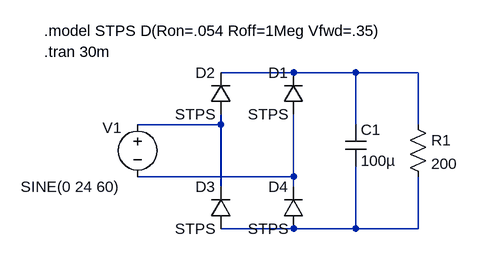
[diagram p0: schematic RectifierC100.asc]
RectifierC100.asc, the LTspice schematic file:
Version 4.1
SHEET 1 880 680
WIRE 240 32 128 32
WIRE 336 32 240 32
WIRE 432 32 336 32
WIRE 128 112 128 96
WIRE 128 112 0 112
WIRE 336 112 336 32
WIRE 432 112 432 32
WIRE 240 192 240 96
WIRE 240 192 0 192
WIRE 128 208 128 112
WIRE 240 208 240 192
WIRE 240 272 128 272
WIRE 336 272 336 176
WIRE 336 272 240 272
WIRE 432 272 432 192
WIRE 432 272 336 272
SYMBOL voltage 0 96 R0
WINDOW 0 -54 21 Left 2
WINDOW 3 -180 112 Left 2
WINDOW 123 0 0 Left 0
WINDOW 39 0 0 Left 0
SYMATTR InstName V1
SYMATTR Value SINE(0 24 60)
SYMBOL res 416 96 R0
SYMATTR InstName R1
SYMATTR Value 200
SYMBOL diode 256 96 R180
WINDOW 0 24 64 Left 2
WINDOW 3 24 0 Left 2
SYMATTR InstName D1
SYMATTR Value STPS
SYMBOL diode 144 96 R180
WINDOW 0 24 64 Left 2
WINDOW 3 24 0 Left 2
SYMATTR InstName D2
SYMATTR Value STPS
SYMBOL diode 144 272 R180
WINDOW 0 24 64 Left 2
WINDOW 3 24 0 Left 2
SYMATTR InstName D3
SYMATTR Value STPS
SYMBOL diode 256 272 R180
WINDOW 0 24 64 Left 2
WINDOW 3 24 0 Left 2
SYMATTR InstName D4
SYMATTR Value STPS
SYMBOL cap 320 112 R0
SYMATTR InstName C1
SYMATTR Value 100µ
TEXT -144 -32 Left 2 !.model STPS D(Ron=.054 Roff=1Meg Vfwd=.35)
TEXT -144 0 Left 2 !.tran 30m

The netlist it stands for:
* RectifierC100.asc
V1 N002 N003 SINE(0 24 60)
R1 N001 N004 200
D1 N003 N001 STPS
D2 N002 N001 STPS
D3 N004 N002 STPS
D4 N004 N003 STPS
C1 N001 N004 100µ
.model D D
.lib standard.dio
.model STPS D(Ron=.054 Roff=1Meg Vfwd=.35)
.tran 30m
.backanno
.end